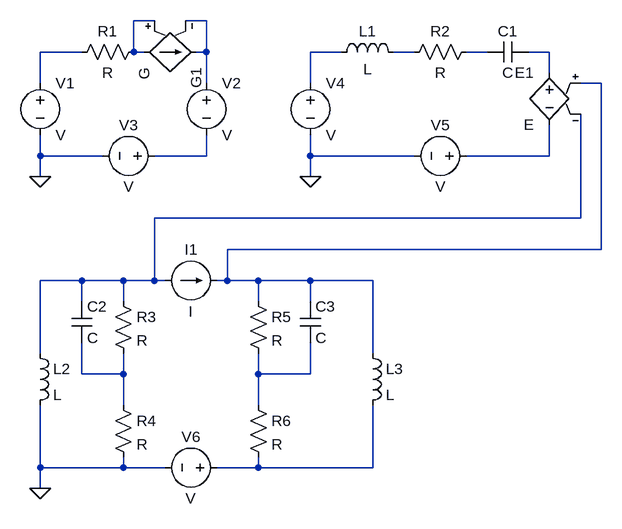
[diagram p0: schematic speaker schematic.asc]
speaker schematic.asc, the LTspice schematic file:
Version 4.1
SHEET 1 964 768
WIRE 272 16 240 16
WIRE 352 16 320 16
WIRE 160 64 96 64
WIRE 240 64 240 16
WIRE 256 64 240 64
WIRE 352 64 352 16
WIRE 352 64 336 64
WIRE 560 64 512 64
WIRE 672 64 640 64
WIRE 784 64 752 64
WIRE 880 64 848 64
WIRE 880 96 880 64
WIRE 96 112 96 64
WIRE 352 112 352 64
WIRE 512 112 512 64
WIRE 960 112 928 112
WIRE 96 224 96 192
WIRE 192 224 96 224
WIRE 352 224 352 192
WIRE 352 224 272 224
WIRE 512 224 512 192
WIRE 672 224 512 224
WIRE 880 224 880 176
WIRE 880 224 752 224
WIRE 96 256 96 224
WIRE 512 256 512 224
WIRE 928 320 928 160
WIRE 928 320 272 320
WIRE 960 368 960 112
WIRE 960 368 384 368
WIRE 160 416 96 416
WIRE 224 416 160 416
WIRE 272 416 272 320
WIRE 272 416 224 416
WIRE 288 416 272 416
WIRE 384 416 384 368
WIRE 384 416 368 416
WIRE 432 416 384 416
WIRE 512 416 432 416
WIRE 608 416 512 416
WIRE 160 448 160 416
WIRE 224 448 224 416
WIRE 432 448 432 416
WIRE 512 448 512 416
WIRE 96 528 96 416
WIRE 608 528 608 416
WIRE 160 560 160 512
WIRE 224 560 224 528
WIRE 224 560 160 560
WIRE 432 560 432 528
WIRE 512 560 512 512
WIRE 512 560 432 560
WIRE 224 608 224 560
WIRE 432 608 432 560
WIRE 96 704 96 608
WIRE 224 704 224 688
WIRE 224 704 96 704
WIRE 288 704 224 704
WIRE 432 704 432 688
WIRE 432 704 368 704
WIRE 608 704 608 608
WIRE 608 704 432 704
WIRE 96 736 96 704
FLAG 96 256 0
FLAG 512 256 0
FLAG 96 736 0
SYMBOL voltage 96 96 R0
SYMATTR InstName V1
SYMBOL res 256 48 R90
WINDOW 0 0 56 VBottom 2
WINDOW 3 32 56 VTop 2
SYMATTR InstName R1
SYMBOL voltage 352 96 R0
SYMATTR InstName V2
SYMBOL g2 352 64 R90
SYMATTR InstName G1
SYMBOL voltage 288 224 R90
WINDOW 0 -32 56 VBottom 2
WINDOW 3 32 56 VTop 2
SYMATTR InstName V3
SYMBOL voltage 512 96 R0
SYMATTR InstName V4
SYMBOL ind 544 80 R270
WINDOW 0 32 56 VTop 2
WINDOW 3 5 56 VBottom 2
SYMATTR InstName L1
SYMBOL res 768 48 R90
WINDOW 0 0 56 VBottom 2
WINDOW 3 32 56 VTop 2
SYMATTR InstName R2
SYMBOL cap 848 48 R90
WINDOW 0 0 32 VBottom 2
WINDOW 3 32 32 VTop 2
SYMATTR InstName C1
SYMBOL voltage 768 224 R90
WINDOW 0 -32 56 VBottom 2
WINDOW 3 32 56 VTop 2
SYMATTR InstName V5
SYMBOL e 880 80 M0
SYMATTR InstName E1
SYMBOL current 288 416 R270
WINDOW 0 32 40 VTop 2
WINDOW 3 -32 40 VBottom 2
SYMATTR InstName I1
SYMBOL res 208 432 R0
SYMATTR InstName R3
SYMBOL cap 144 448 R0
SYMATTR InstName C2
SYMBOL ind 80 512 R0
SYMATTR InstName L2
SYMBOL res 208 592 R0
SYMATTR InstName R4
SYMBOL voltage 384 704 R90
WINDOW 0 -32 56 VBottom 2
WINDOW 3 32 56 VTop 2
SYMATTR InstName V6
SYMBOL ind 592 512 R0
SYMATTR InstName L3
SYMBOL res 416 432 R0
SYMATTR InstName R5
SYMBOL cap 496 448 R0
SYMATTR InstName C3
SYMBOL res 416 592 R0
SYMATTR InstName R6

The netlist it stands for:
* speaker schematic.asc
V1 N003 0 V
R1 N001 N003 R
V2 N002 N009 V
G1 N001 N002 N001 N002 G
V3 N009 0 V
V4 N004 0 V
L1 N004 N005 L
R2 N006 N005 R
C1 N007 N006 C
V5 N010 0 V
E1 N007 N010 N008 N011 E
I1 N011 N008 I
R3 N011 N012 R
C2 N011 N012 C
L2 N011 0 L
R4 N012 0 R
V6 N014 0 V
L3 N008 N014 L
R5 N008 N013 R
C3 N008 N013 C
R6 N013 N014 R
.backanno
.end